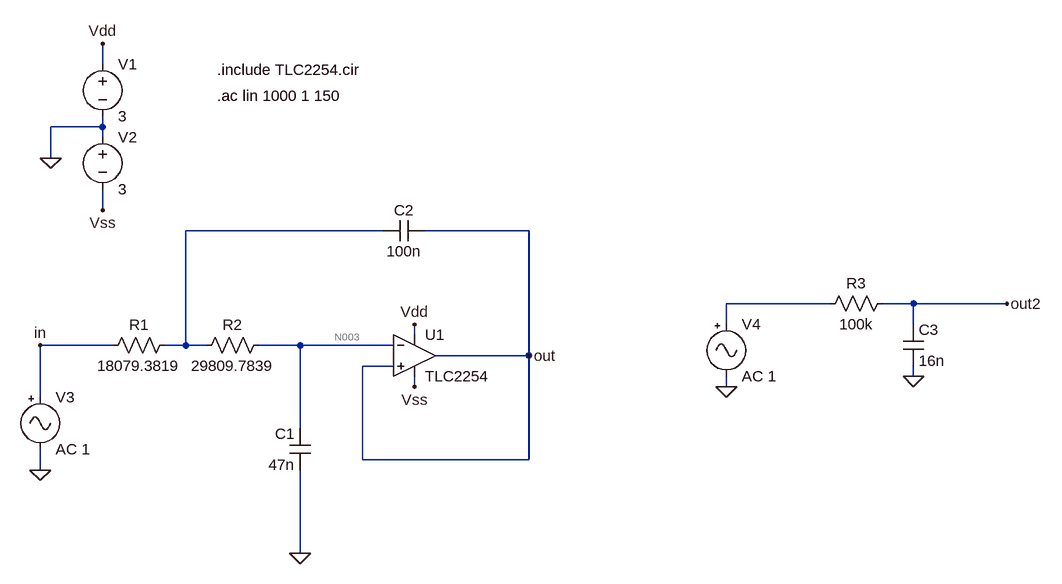
[diagram p0: schematic passa_baixas_vcvs_2_ordem.asc]
passa_baixas_vcvs_2_ordem.asc, the LTspice schematic file:
Version 4
SHEET 1 1384 680
WIRE -272 -272 -272 -304
WIRE -272 -176 -272 -192
WIRE -272 -176 -352 -176
WIRE -272 -160 -272 -176
WIRE -352 -128 -352 -176
WIRE -272 -48 -272 -80
WIRE 160 -16 -144 -16
WIRE 384 -16 224 -16
WIRE 848 96 688 96
WIRE 976 96 928 96
WIRE 1120 96 976 96
WIRE 688 128 688 96
WIRE 976 128 976 96
WIRE 208 144 208 128
WIRE -256 160 -368 160
WIRE -144 160 -144 -16
WIRE -144 160 -176 160
WIRE -112 160 -144 160
WIRE 32 160 -32 160
WIRE 176 160 32 160
WIRE 384 176 384 -16
WIRE 384 176 240 176
WIRE 176 192 128 192
WIRE 976 208 976 192
WIRE 208 224 208 208
WIRE 688 224 688 208
WIRE -368 240 -368 160
WIRE 32 288 32 160
WIRE 128 336 128 192
WIRE 384 336 384 176
WIRE 384 336 128 336
WIRE -368 352 -368 320
WIRE 32 480 32 352
FLAG 32 480 0
FLAG -352 -128 0
FLAG -272 -304 Vdd
FLAG 208 128 Vdd
FLAG 208 224 Vss
FLAG -272 -48 Vss
FLAG -368 352 0
FLAG 384 176 out
FLAG -368 160 in
FLAG 976 208 0
FLAG 1120 96 out2
FLAG 688 224 0
SYMBOL Opamps\\TLC2254 208 112 R0
SYMATTR InstName U1
SYMATTR SpiceModel TLC2254
SYMBOL voltage -272 -288 R0
SYMATTR InstName V1
SYMATTR Value 3
SYMBOL voltage -272 -176 R0
SYMATTR InstName V2
SYMATTR Value 3
SYMBOL Misc\\signal -368 224 R0
WINDOW 123 0 0 Left 2
WINDOW 39 0 0 Left 2
SYMATTR InstName V3
SYMATTR Value AC 1
SYMBOL res -16 144 R90
WINDOW 0 0 56 VBottom 2
WINDOW 3 32 56 VTop 2
SYMATTR InstName R2
SYMATTR Value 29809.7839
SYMBOL res -160 144 R90
WINDOW 0 0 56 VBottom 2
WINDOW 3 32 56 VTop 2
SYMATTR InstName R1
SYMATTR Value 18079.3819
SYMBOL cap 48 352 R180
WINDOW 0 24 56 Left 2
WINDOW 3 24 8 Left 2
SYMATTR InstName C1
SYMATTR Value 47n
SYMBOL cap 160 0 R270
WINDOW 0 32 32 VTop 2
WINDOW 3 0 32 VBottom 2
SYMATTR InstName C2
SYMATTR Value 100n
SYMBOL res 944 80 R90
WINDOW 0 0 56 VBottom 2
WINDOW 3 32 56 VTop 2
SYMATTR InstName R3
SYMATTR Value 100k
SYMBOL cap 960 128 R0
SYMATTR InstName C3
SYMATTR Value 16n
SYMBOL Misc\\signal 688 112 R0
SYMATTR InstName V4
SYMATTR Value AC 1
TEXT -96 -224 Left 2 !.ac lin 1000 1 150
TEXT -96 -264 Left 2 !.include TLC2254.cir

The netlist it stands for:
* passa_baixas_vcvs_2_ordem.asc
XU1 out N003 Vdd Vss out TLC2254 TLC2254  ; pins In+ In- V+ V- OUT
V1 Vdd 0 3
V2 0 Vss 3
V3 in 0 AC 1
R2 N003 N001 29809.7839
R1 N001 in 18079.3819
C1 0 N003 47n
C2 N001 out 100n
R3 out2 N002 100k
C3 out2 0 16n
V4 N002 0 AC 1
.ac lin 1000 1 150
.include TLC2254.cir
.backanno
.end

* Results of the author's LTspice run, read from the files saved beside the schematic
* Operating Point, zero values left out:
*   V(out) = 5.607 µV
*   V(vss) = -3 V
*   V(vdd) = 3 V
*   V(n003) = -4.698 nV
*   I(V2) = -87.1 µA
*   I(V1) = -87.1 µA
*   Ix(u1:3) = 87.1 µA
*   Ix(u1:4) = -87.1 µA
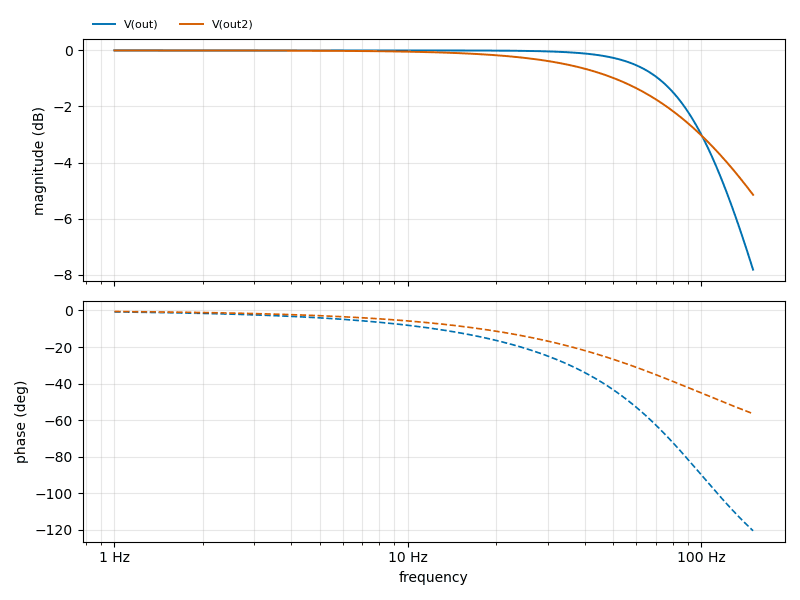
[diagram p1: AC Analysis of passa_baixas_vcvs_2_ordem.asc, plotted from the saved traces]
* AC Analysis, 1 run:
*   V(out): 0.00 dB at 1 Hz, -7.82 dB at 150 Hz, peak 0.00 dB at 1 Hz, 3 dB below the peak at 100 Hz
*   V(out2): -0.00 dB at 1 Hz, -5.15 dB at 150 Hz, peak -0.00 dB at 1 Hz, 3 dB below the peak at 99.48 Hz